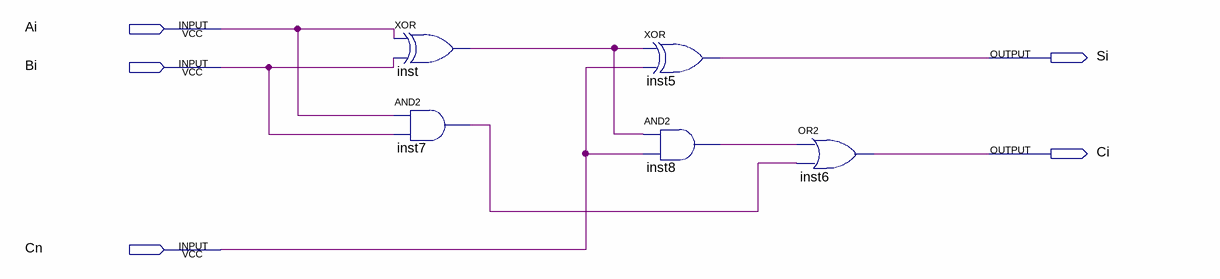
[diagram p0: schematic sheet]
// Quartus schematic Add_Complet.bdf as structural Verilog: 5 symbols, 5 pins
module Add_Complet (
  input  Ai,
  input  Bi,
  input  Cn,
  output Si,
  output Ci
);

  wire inst7_out, inst8_out, inst_out;

  xor inst (inst_out, Ai, Bi);
  and inst7 (inst7_out, Ai, Bi);
  xor inst5 (Si, inst_out, Cn);
  and inst8 (inst8_out, inst_out, Cn);
  or inst6 (Ci, inst8_out, inst7_out);
endmodule
